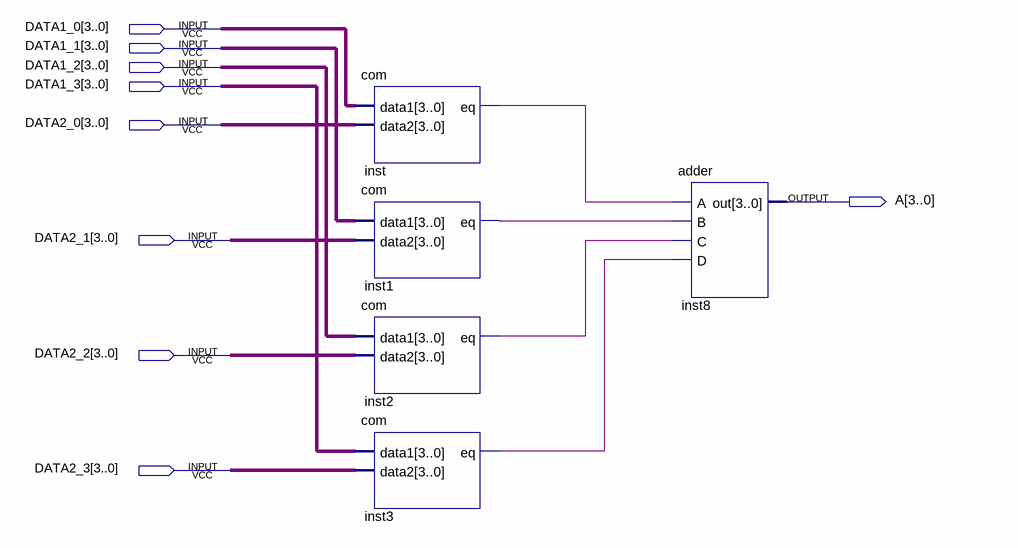
[diagram p0: schematic sheet]
// Quartus schematic A.bdf as structural Verilog: 5 symbols, 9 pins
module A (
  input  [3:0] DATA1_0,
  input  [3:0] DATA1_1,
  input  [3:0] DATA1_2,
  input  [3:0] DATA1_3,
  input  [3:0] DATA2_0,
  input  [3:0] DATA2_1,
  input  [3:0] DATA2_2,
  input  [3:0] DATA2_3,
  output [3:0] A
);

  wire inst1_eq, inst2_eq, inst3_eq, inst_eq;

  com inst (.data1(DATA1_0), .data2(DATA2_0), .eq(inst_eq));
  com inst1 (.data1(DATA1_1), .data2(DATA2_1), .eq(inst1_eq));
  com inst2 (.data1(DATA1_2), .data2(DATA2_2), .eq(inst2_eq));
  com inst3 (.data1(DATA1_3), .data2(DATA2_3), .eq(inst3_eq));
  adder inst8 (.A(inst_eq), .B(inst1_eq), .C(inst2_eq), .D(inst3_eq), .out(A));
endmodule
